# Altium schematic sheet 7-Gyroscope.SchDoc
size A4
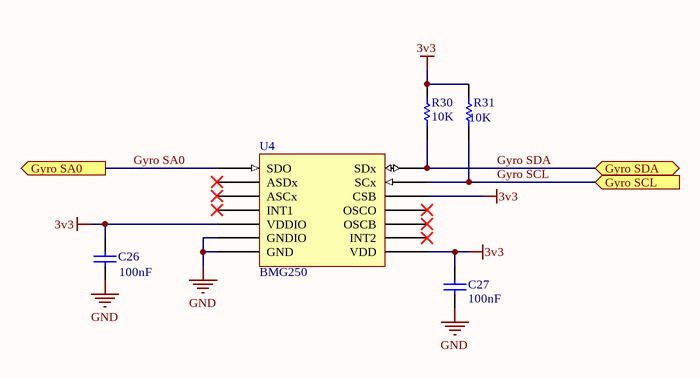
[diagram p0: 7-Gyroscope.SchDoc]

## Parts
C26  100nF  [CAPC1608X90X30ML10T20]
C27  100nF  [CAPC1608X90X30ML10T20]
R30  10K  [RESC0603(1608)_N]
R31  10K  [RESC0603(1608)_N]
U4  BMG250  [BMG250]

## Ports
Gyro SA0 (out), Gyro SCL (in), Gyro SDA (bidir)

## Nets
3v3: C26.2 C27.2 R30.2 R31.2 U4.5(VDDIO) U4.8(VDD) U4.12(CSB)
GND: C26.1 C27.1 U4.6(GNDIO) U4.7(GND)
Gyro SA0: U4.1(SDO) ; port Gyro SA0
Gyro SCL: R31.1 U4.13(SCx) ; port Gyro SCL
Gyro SDA: R30.1 U4.14(SDx) ; port Gyro SDA

Not connected (* = marked no-connect by the designer): U4 2(ASDx)* 3(ASCx)* 4(INT1)* 9(INT2)* 10(OSCB)* 11(OSCO)*

## Library data of the parts
C26 C27 = CMP-2000-06092-1: Chip Capacitor, 100 nF, +/- 10%, 50 V, -55 to 125 degC, 0603 (1608 Metric), RoHS, Tape and Reel; Manufacturer: SamsungElectro-Mechanics; Product Length: 1.6mm; Voltage: 50Vdc; Product Height: 0.8mm; Rad Hard: No; Capacitance Value: 0.1uF; Dielectric: X7R; Packaging: Tape&Reel; Package Description: 2-Pin Surface Mount Device, Body 1.60 x 0.80 mm; Package Reference: 0603; Datasheet Version: 06/2016; Operating Temperature: -55to125°C; Category: CapacitorCeramicMultilayer; Product Depth: 0.8mm; Mounting Technology: SurfaceMount; Package/Case: 0603; Tolerance: 10%; Manufacturer URL: http://www.samsungsem.com/global/index.jsp; Construction: Flat; Mounting: SurfaceMount; Datasheet URL: http://www.samsungsem.com/kr/support/product-search/mlcc/__icsFiles/afieldfile/2016/08/18/S_CL10B104KB8SFNC.pdf
R30 R31 = CMP-1012-00098-1: 10K 0.1W 5% 0603 (1608 Metric)  SMD; Case-EIA: 0603; Value: 10000.00 Ohm; Case-Metric: 1608; Technology: SMT; Tolerance: 5 %; Power: 0.1 W
U4 = BMG250: 3 Axis Gyroscope